# Altium schematic sheet ESP32.SchDoc
size A3; Organization: Miltera; Address1: Bilişim Vadisi Muallim Mah.; Address2: Deniz Cad.; Address3: No:143/5 A7 Blok; Address4: Kat:2 Kapı No:35; SheetNumber: 3; SheetTotal: 7
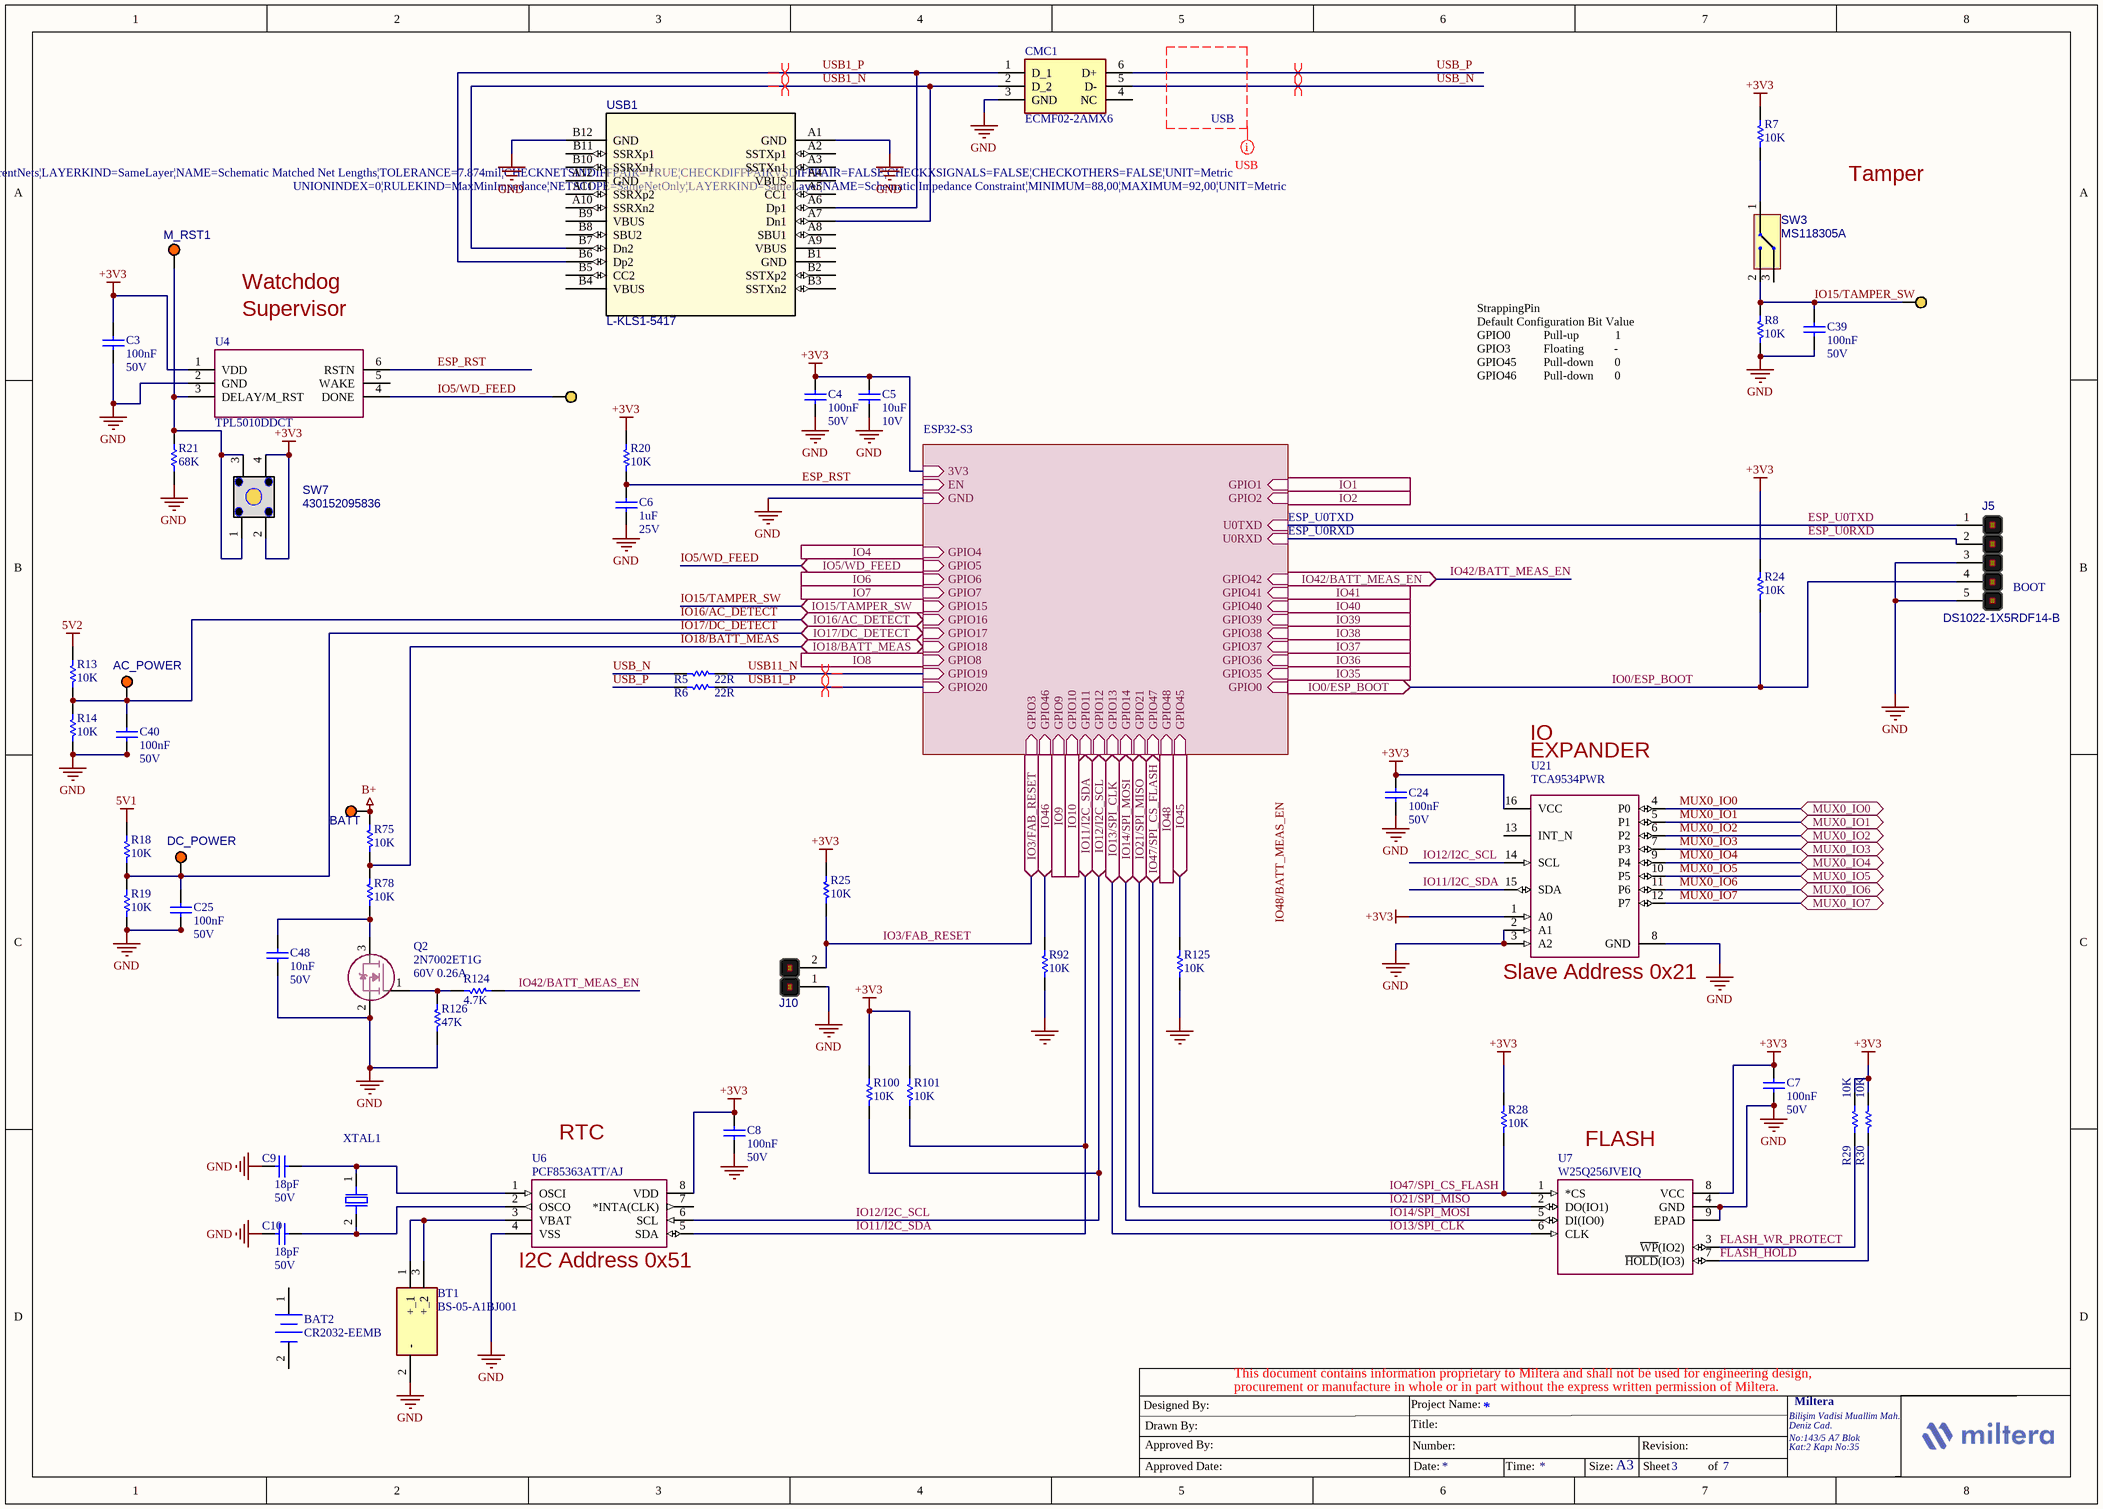
[diagram p0: ESP32.SchDoc]

## Parts
AC_POWER  L-KLS8-TP5003  [TEST_POINT_ORANGE]  (value not drawn)  (no BOM)
BAT2  CR2032-EEMB  (mechanical)
BATT  L-KLS8-TP5003  [TEST_POINT_ORANGE]  (value not drawn)  (no BOM)
BT1  BS-05-A1BJ001  [17754851]
C3  value 100nF  Voltage: 50V  [CAP_0603]  (hidden comment: CAP)
C4  value 100nF  Voltage: 50V  [CAP_0603]  (hidden comment: CAP)
C5  value 10uF  Voltage: 10V  [CAP_0603]  (hidden comment: CAP)
C6  value 1uF  Voltage: 25V  [CAP_0603]  (hidden comment: CAP)
C7  value 100nF  Voltage: 50V  [CAP_0603]  (hidden comment: CAP)
C8  value 100nF  Voltage: 50V  [CAP_0603]  (hidden comment: CAP)
C9  value 18pF  Voltage: 50V  [CAP_0603]  (hidden comment: CAP)
C10  value 18pF  Voltage: 50V  [CAP_0603]  (hidden comment: CAP)
C24  value 100nF  Voltage: 50V  [CAP_0603]  (hidden comment: CAP)
C25  value 100nF  Voltage: 50V  [CAP_0603]  (hidden comment: CAP)
C39  value 100nF  Voltage: 50V  [CAP_0603]  (hidden comment: CAP)
C40  value 100nF  Voltage: 50V  [CAP_0603]  (hidden comment: CAP)
C48  value 10nF  Voltage: 50V  [CAP_0603]  (hidden comment: CL10B103KB8NNNC)
CMC1  ECMF02-2AMX6  [SON50P150X170X55-6N-D]
DC_POWER  L-KLS8-TP5003  [TEST_POINT_ORANGE]  (value not drawn)  (no BOM)
J5  DS1022-1X5RDF14-B  [PIN_HEADER_MALE_TH_1x5_2.54mm]
J10  L-KLS1-207-1-02-S  [PIN HEADER 2PIN(1x2) 2.54mm THT V/T]  (value not drawn)
M_RST1  L-KLS8-TP5003  [TEST_POINT_ORANGE]  (value not drawn)  (no BOM)
Q2  2N7002ET1G  value 60V 0.26A  [SOT23]
R5  value 22R  [RES_0603]  (hidden comment: RES)
R6  value 22R  [RES_0603]  (hidden comment: RES)
R7  value 10K  [RES_0603]  (hidden comment: RES)
R8  value 10K  [RES_0603]  (hidden comment: RES)
R13  value 10K  [RES_0603]  (hidden comment: RES)
R14  value 10K  [RES_0603]  (hidden comment: RES)
R18  value 10K  [RES_0603]  (hidden comment: RES)
R19  value 10K  [RES_0603]  (hidden comment: RES)
R20  value 10K  [RES_0603]  (hidden comment: RES)
R21  value 68K  [RES_0603]  (hidden comment: 0603SAF6802T5E)
R24  value 10K  [RES_0603]  (hidden comment: RES)
R25  value 10K  [RES_0603]  (hidden comment: RES)
R28  value 10K  [RES_0603]  (hidden comment: RES)
R29  value 10K  [RES_0603]  (hidden comment: RES)
R30  value 10K  [RES_0603]  (hidden comment: RES)
R75  value 10K  [RES_0603]  (hidden comment: RES)
R78  value 10K  [RES_0603]  (hidden comment: RES)
R92  value 10K  [RES_0603]  (hidden comment: RES)
R100  value 10K  [RES_0603]  (hidden comment: RES)
R101  value 10K  [RES_0603]  (hidden comment: RES)
R124  value 4.7K  [RES_0603]  (hidden comment: RES)
R125  value 10K  [RES_0603]  (hidden comment: RES)
R126  value 47K  [RES_0603]  (hidden comment: RES)
SW3  MS118305A  [MS118305A]
SW7  430152095836  [SMD_TACT_SW_6x6_9.50mm]
TAMPER_SW  L-KLS8-TP5004  [TEST_POINT_YELLOW]  (value not drawn)
U4  TPL5010DDCT  [SOT95P280X110-6N]
U6  PCF85363ATT/AJ  [TSSOP8_SOT505-1_NXP]
U7  W25Q256JVEIQ  [8-WSON (8x6)]
U21  TCA9534PWR  [16-TSSOP]
USB1  L-KLS1-5417  [217C-AA01_ATT]
WD_FEED1  L-KLS8-TP5004  [TEST_POINT_YELLOW]  (value not drawn)
XTAL1  Crystal_2pin  [XTAL_3x8]  (value not drawn)

## Sub-sheets
ESP32-S3 = ESP_SoC.SchDoc: 3V3 (in), EN (in), GND (in), GPIO4 (in), GPIO5 (in), GPIO6 (in), GPIO7 (in), GPIO15 (in), GPIO16 (in), GPIO17 (in), GPIO18 (in), GPIO8 (in), GPIO19 (in), GPIO20 (in), GPIO3 (in), GPIO46 (in), GPIO9 (in), GPIO10 (in), GPIO11 (in), GPIO12 (in), GPIO13 (in), GPIO14 (in), GPIO21 (in), GPIO47 (in), GPIO48 (in), GPIO45 (in), U0TXD (in), U0RXD (in), GPIO42 (in), GPIO41 (in), GPIO40 (in), GPIO39 (in), GPIO38 (in), GPIO37 (in), GPIO36 (in), GPIO35 (in), GPIO0 (in), GPIO1 (in), GPIO2 (in)

## Ports
IO0/ESP_BOOT (in), IO1 (in), IO2 (in), IO3/FAB_RESET (in), IO4 (in), IO5/WD_FEED (in), IO6 (in), IO7 (in), IO8 (in), IO9 (in), IO10 (in), IO11/I2C_SDA (bidir), IO12/I2C_SCL (bidir), IO13/SPI_CLK (bidir), IO14/SPI_MOSI (bidir), IO15/TAMPER_SW (in), IO16/AC_DETECT (bidir), IO17/DC_DETECT (bidir), IO18/BATT_MEAS (bidir), IO21/SPI_MISO (bidir), IO35 (in), IO36 (in), IO37 (in), IO38 (in), IO39 (in), IO40 (in), IO41 (in), IO42/BATT_MEAS_EN (in), IO45 (in), IO46 (in), IO47/SPI_CS_FLASH (bidir), IO48 (in), MUX0_IO0 (bidir), MUX0_IO1 (bidir), MUX0_IO2 (bidir), MUX0_IO3 (bidir), MUX0_IO4 (bidir), MUX0_IO5 (bidir), MUX0_IO6 (bidir), MUX0_IO7 (bidir)

## Nets
5V1: R18.1
5V2: R13.1
+3V3: C3.1 C4.1 C5.1 C7.1 C8.1 C24.1 R7.1 R20.1 R24.1 R25.1 R28.1 R29.1 R30.1 R100.1 R101.1 SW7.2 SW7.4 U4.1(VDD) U6.8(VDD) U7.8(VCC) U21.1(A0) U21.16(VCC) ; sheet ESP32-S3/3V3
B+: BATT.1 R75.1
GND: BT1.2(-) C3.2 C4.2 C5.2 C6.2 C7.2 C8.2 C9.1 C10.1 C24.2 C25.2 C39.2 C40.2 C48.2 CMC1.3(GND) J5.3 J5.5 J10.1 Q2.2(S) R8.2 R14.2 R19.2 R21.2 R92.2 R125.2 R126.2 U4.2(GND) U6.4(VSS) U7.4(GND) U7.9(EPAD) U21.2(A1) U21.3(A2) U21.8(GND) USB1.A1(GND) USB1.B12(GND) ; sheet ESP32-S3/GND
ESP_RST: C6.1 R20.2 U4.6(RSTN) ; sheet ESP32-S3/EN
ESP_U0RXD: J5.2 ; sheet ESP32-S3/U0RXD
ESP_U0TXD: J5.1 ; sheet ESP32-S3/U0TXD
FLASH_HOLD: R30.2 U7.7(~{HOLD}(IO3))
FLASH_WR_PROTECT: R29.2 U7.3(~{WP}(IO2))
IO0/ESP_BOOT: J5.4 R24.2 ; port IO0/ESP_BOOT, sheet ESP32-S3/GPIO0
IO1: port IO1, sheet ESP32-S3/GPIO1
IO2: port IO2, sheet ESP32-S3/GPIO2
IO3/FAB_RESET: J10.2 R25.2 ; port IO3/FAB_RESET, sheet ESP32-S3/GPIO3
IO4: port IO4, sheet ESP32-S3/GPIO4
IO5/WD_FEED: U4.4(DONE) WD_FEED1.1 ; port IO5/WD_FEED, sheet ESP32-S3/GPIO5
IO6: port IO6, sheet ESP32-S3/GPIO6
IO7: port IO7, sheet ESP32-S3/GPIO7
IO8: port IO8, sheet ESP32-S3/GPIO8
IO9: port IO9, sheet ESP32-S3/GPIO9
IO10: port IO10, sheet ESP32-S3/GPIO10
IO11/I2C_SDA: R101.2 U6.5(SDA) U21.15(SDA) ; port IO11/I2C_SDA, sheet ESP32-S3/GPIO11
IO12/I2C_SCL: R100.2 U6.6(SCL) U21.14(SCL) ; port IO12/I2C_SCL, sheet ESP32-S3/GPIO12
IO13/SPI_CLK: U7.6(CLK) ; port IO13/SPI_CLK, sheet ESP32-S3/GPIO13
IO14/SPI_MOSI: U7.5(DI(IO0)) ; port IO14/SPI_MOSI, sheet ESP32-S3/GPIO14
IO15/TAMPER_SW: C39.1 R8.1 SW3.2 TAMPER_SW.1 ; port IO15/TAMPER_SW, sheet ESP32-S3/GPIO15
IO16/AC_DETECT: AC_POWER.1 C40.1 R13.2 R14.1 ; port IO16/AC_DETECT, sheet ESP32-S3/GPIO16
IO17/DC_DETECT: C25.1 DC_POWER.1 R18.2 R19.1 ; port IO17/DC_DETECT, sheet ESP32-S3/GPIO17
IO18/BATT_MEAS: R75.2 R78.1 ; port IO18/BATT_MEAS, sheet ESP32-S3/GPIO18
IO21/SPI_MISO: U7.2(DO(IO1)) ; port IO21/SPI_MISO, sheet ESP32-S3/GPIO21
IO35: port IO35, sheet ESP32-S3/GPIO35
IO36: port IO36, sheet ESP32-S3/GPIO36
IO37: port IO37, sheet ESP32-S3/GPIO37
IO38: port IO38, sheet ESP32-S3/GPIO38
IO39: port IO39, sheet ESP32-S3/GPIO39
IO40: port IO40, sheet ESP32-S3/GPIO40
IO41: port IO41, sheet ESP32-S3/GPIO41
IO42/BATT_MEAS_EN: R124.1 ; port IO42/BATT_MEAS_EN, sheet ESP32-S3/GPIO42
IO45: R125.1 ; port IO45, sheet ESP32-S3/GPIO45
IO46: R92.1 ; port IO46, sheet ESP32-S3/GPIO46
IO47/SPI_CS_FLASH: R28.2 U7.1(*CS) ; port IO47/SPI_CS_FLASH, sheet ESP32-S3/GPIO47
IO48: port IO48, sheet ESP32-S3/GPIO48
MUX0_IO0: U21.4(P0) ; port MUX0_IO0
MUX0_IO1: U21.5(P1) ; port MUX0_IO1
MUX0_IO2: U21.6(P2) ; port MUX0_IO2
MUX0_IO3: U21.7(P3) ; port MUX0_IO3
MUX0_IO4: U21.9(P4) ; port MUX0_IO4
MUX0_IO5: U21.10(P5) ; port MUX0_IO5
MUX0_IO6: U21.11(P6) ; port MUX0_IO6
MUX0_IO7: U21.12(P7) ; port MUX0_IO7
USB1_N: CMC1.2(D_2) USB1.A7(Dn1) USB1.B7(Dn2)
USB1_P: CMC1.1(D_1) USB1.A6(Dp1) USB1.B6(Dp2)
USB11_N: R5.2 ; sheet ESP32-S3/GPIO19
USB11_P: R6.2 ; sheet ESP32-S3/GPIO20
USB_N: CMC1.5(D-) R5.1
USB_P: CMC1.6(D+) R6.1
NetBT1_1: BT1.1(+_1) BT1.3(+_2) U6.3(VBAT)
NetC9_2: C9.2 U6.1(OSCI) XTAL1.1
NetC10_2: C10.2 U6.2(OSCO) XTAL1.2
NetC48_1: C48.1 Q2.3(D) R78.2
NetM_RST1_1: M_RST1.1 R21.1 SW7.1 SW7.3 U4.3(DELAY/M_RST)
NetQ2_1: Q2.1(G) R124.2 R126.1
NetR7_2: R7.2 SW3.1

Not connected (* = marked no-connect by the designer): BAT2 1(+) 2(-); CMC1 4(NC); SW3 3; U4 5(WAKE); U6 7(*INTA(CLK)); U21 13(INT_N); USB1 A2(SSTXp1) A3(SSTXn1) A4(VBUS) A5(CC1) A8(SBU1) A9(VBUS) A10(SSRXn2) A11(SSRXp2) A12(GND) B1(GND) B2(SSTXp2) B3(SSTXn2) B4(VBUS) B5(CC2) B8(SBU2) B9(VBUS) B10(SSRXn1) B11(SSRXp1)

## Layout directives
net class USB; rule Impedance Constraint [Min = 88.00    Max = 92.00    ]; rule Matched Net Lengths [Tolerance = 0.2mm]: (no net found under the mark)
differential pair; differential pair class USB1: USB_N, USB_P
differential pair; differential pair class USB11: USB1_N, USB1_P
differential pair; differential pair class USB111: USB11_N, USB11_P

## Notes on the sheet
- Tamper
- Watchdog
- (near U4) Supervisor
- StrappingPin
  Default Configuration Bit Value
  GPIO0           Pull-up            1
  GPIO3           Floating          -
  GPIO45         Pull-down       0
  GPIO46         Pull-down       0
- ESP_U0TXD
- ESP_U0RXD
- (near J5) BOOT
- IO
- (near U21) EXPANDER
- (near U21) Slave Address 0x21
- (near U6) RTC
- (near U7) FLASH
- (near U6) I2C Address 0x51
- Labels drawn without touching a wire or pin: IO48/BATT_MEAS_EN
- This document contains information proprietary to Miltera and shall not be used for engineering design,
- procurement or manufacture in whole or in part without the express written permission of Miltera.
- Designed By:
- Drawn By:
- Approved By:
- Title:
- Project Name:
- Number:
- Revision:
- Approved Date:
- Date:
- Time:
- Size:
- A3
- Sheet
- of

## Library data of the parts
AC_POWER BATT DC_POWER M_RST1 = 5003: PC TEST POINT MINIATURE ORANGE 2.54MMX4.60MM; Manufacturer: KLS ELECTRONIC; Package: 1mm THT Pad; Manufacturer Part Number: L-KLS8-TP5003
BAT2 = J00241: BATTERY 3V 210mA PINSIZ EEMB; Manufacturer: EEMB; Manufacturer Part Number: CR2032-EEMB
BT1 = 1775485-1: BATTERY HOLDER COIN CR2032 TH; Manufacturer: MYOUNG; Manufacturer Part Number: BS-05-A1BJ001
C3 C4 C7 C8 C24 C25 C39 C40 = C01763: CAP CER 100nF 50VDC %10 X7R SMD; Manufacturer: Samsung; Manufacturer Part Number: CL10B104KB8NNNL
C5 = C01793: MLCC (1608) 0603 10uF 10VDC ±20% X5R; Manufacturer: Samsung; Manufacturer Part Number: CL10A106MP8NNNC
C6 = C01757: CAP CER 1UF 25VDC %10 X5R SMD; Manufacturer: Samsung; Manufacturer Part Number: CL10A105KA8NNNC
C9 C10 = C01771: MLCC (1608) 0603 18pF 50VDC ±5% C0G (NP0); Manufacturer: Samsung; Manufacturer Part Number: CL10C180JB8NNNC
C48 = C01763: MLCC (1608) 0603 10nF 50VDC ±10% X7R; Manufacturer: SAMSUNG; Manufacturer Part Number: CL10B103KB8NNNC
CMC1 = ECMF02-2AMX6: CHOKE COMMON MODE CMC 200MA 2LN 2.5 OHM SMD; Manufacturer: STMicroelectronics; Manufacturer Part Number: ECMF02-2AMX6
J5 = 2355172-5: PIN HEADER 5PIN(1x5) 2.54mm THT R/A; Manufacturer: CONNFLY; Manufacturer Part Number: DS1022-1X5RDF14-B; Value: DS1022-1X5RDF14-B
J10 = L-KLS1-207-1-02-S: PIN HEADER 2PIN(1x2) 2.54mm THT V/T; Manufacturer: KLS ELECTRONIC; Manufacturer Part Number: L-KLS1-207-1-02-S
Q2 = 2N7002ET1G: MOSFET N-CH 60V 260mA SOT-23; Manufacturer: On Semiconductor; Manufacturer Part Number: 2N7002ET1G; Package: SOT-23
R5 R6 = R03002: RES 0603 22 Ohms 5% 1/10W-S 100PPM; Manufacturer: ROYALOHM; Manufacturer Part Number: 0603SAJ0220T5E
R7 R8 R13 R14 R18-R20 R24 R25 R28-R30 R75 R78 R92 R100 R101 R125 = R02995: RES 0603 10k Ohms %1 1/10W 100PPM; Manufacturer: ROYALOHM; Manufacturer Part Number: 0603SAF1002T5E
R21 = R03103: RES. 0603 68K Ohms 1% 1/10W-S 100PPM; Manufacturer: ROYALOHM; Manufacturer Part Number: 0603SAF6802T5E
R124 = R02994: RES 0603 4.7k Ohms %1 1/10W 100PPM; Manufacturer: ROYALOHM; Manufacturer Part Number: 0603SAF4701T5E
R126 = R03000: RES 0603 47K Ohms 1% 1/10W-S 100PPM; Manufacturer: ROYALOHM; Manufacturer Part Number: 0603SAF4702T5E
SW3 = MS118305A: SWITCH MICRO SPDT 100mA 30VDC 25gF; Manufacturer: LITTELFUSE-C&K; Manufacturer Part Number: MS118305A; Value: MS118305A
SW7 = 430152095836: SWITCH TACT 6.2x6.2 9.50mm 360gF SMT V/T; Manufacturer: Würth Elektronik; Manufacturer Part Number: 430152095836; Value: 430152095836
TAMPER_SW WD_FEED1 = 5004: PC TEST POINT MINIATURE YELLOW 2.54MMX4.60MM; Manufacturer: KLS ELECTRONIC; Package: 1mm THT Pad; Manufacturer Part Number: L-KLS8-TP5004
U4 = TPL5010DDCT: IC OSC PROG TIMER TSOT23-6; Manufacturer: Texas Instruments; Manufacturer Part Number: TPL5010DDCT
U6 = PCF85363ATT/AJ: IC RTC CLK/CALENDAR I2C 8TSSOP; Manufacturer: NXP USA Inc.; Manufacturer Part Number: PCF85363ATT/AJ
U7 = W25Q256JVEIQ: IC FLASH 256MBIT SPI/QUAD 8WSON; Manufacturer: Winbond Electronics; Manufacturer Part Number: W25Q256JVEIQ
U21 = TCA9534PWR: IC XPNDR 400KHZ I2C 16TSSOP; Manufacturer: Texas Instruments; Manufacturer Part Number: TCA9534PWR
USB1 = L-KLS1-5461: CONNECTOR USB 14P USB FEMALE SOCKET C TYPE; Manufacturer: KLS ELECTRONIC; Package: SMT R/T; Manufacturer Part Number: L-KLS1-5417; Value: L-KLS1-5417
XTAL1 = Q00517: CRYSTAL 32.768KHZ 12.5PF 5ppm 3x8; Manufacturer Part Number: R38-32.768-12.5-EXT-5PPM; Manufacturer: Raltron